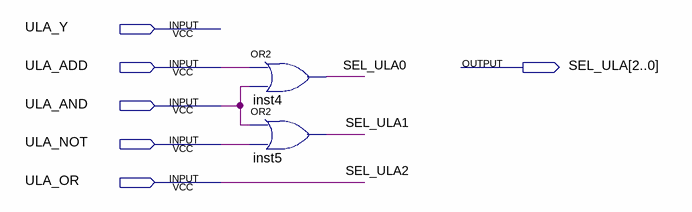
[diagram p0: schematic sheet]
// Quartus schematic ULA_encoder.bdf as structural Verilog: 2 symbols, 6 pins
module ULA_encoder (
  input  ULA_Y,
  input  ULA_ADD,
  input  ULA_AND,
  input  ULA_NOT,
  input  ULA_OR,
  output [2:0] SEL_ULA
);

  or inst4 (SEL_ULA[0], ULA_ADD, ULA_AND);
  or inst5 (SEL_ULA[1], ULA_AND, ULA_NOT);

  assign SEL_ULA[2] = ULA_OR;

  // Other names for the same wires on the sheet: SEL_ULA2 = ULA_OR
endmodule
